# Altium schematic sheet Radio.SchDoc
size A
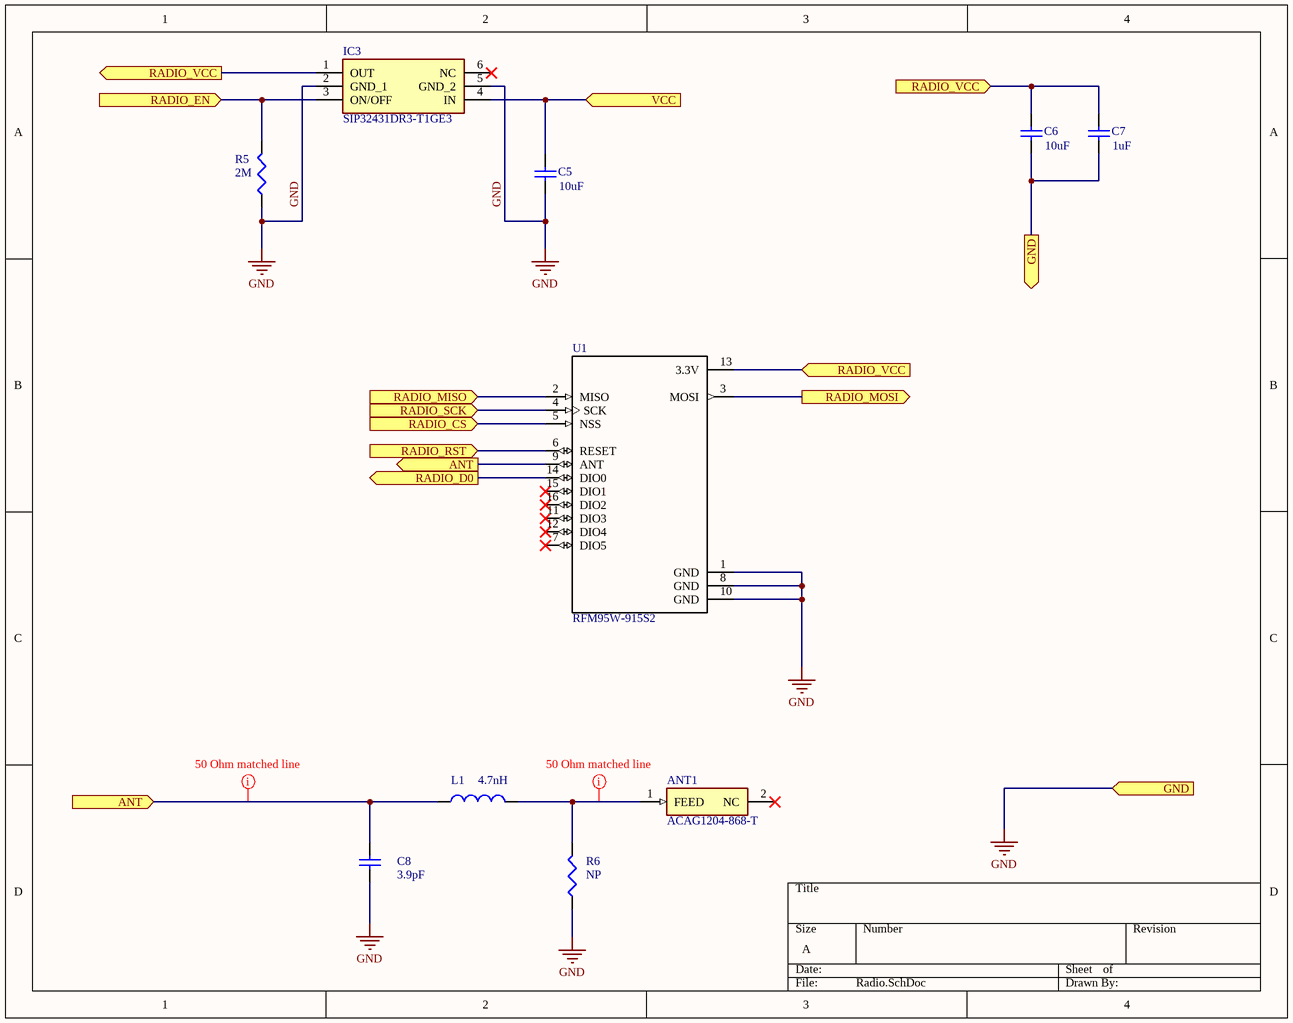
[diagram p0: Radio.SchDoc]

## Parts
ANT1  ACAG1204-868-T  [ANTC12040X170N]
C5  value 10uF  [1608[0603]]  (hidden comment: Cap)
C6  value 10uF  [1608[0603]]  (hidden comment: Cap)
C7  value 1uF  [1608[0603]]  (hidden comment: Cap)
C8  value 3.9pF  [1608[0603]]
IC3  SIP32431DR3-T1GE3  [SOT65P210X110-6N]
L1  value 4.7nH  [1608[0603]]
R5  value 2M  [J1-0603]  (hidden comment: Res3)
R6  value NP  [1608[0603]]
U1  RFM95W-915S2  [*XCVR_RFM69HW-868S2]

## Ports
ANT (in), ANT (out), GND (in), GND (out), RADIO_CS (in), RADIO_D0 (out), RADIO_EN (in), RADIO_MISO (in), RADIO_MOSI (out), RADIO_RST (in), RADIO_SCK (in), RADIO_VCC (in), RADIO_VCC (out), VCC (in)

## Nets
GND: C5.1 C6.1 C7.1 C8.1 IC3.2(GND_1) IC3.5(GND_2) R5.1 R6.1 U1.1(GND) U1.8(GND) U1.10(GND) ; port GND
ANT: C8.2 L1.1 U1.9(ANT) ; port ANT
RADIO_CS: U1.5(NSS) ; port RADIO_CS
RADIO_D0: U1.14(DIO0) ; port RADIO_D0
RADIO_EN: IC3.3(ON/OFF) R5.2 ; port RADIO_EN
RADIO_MISO: U1.2(MISO) ; port RADIO_MISO
RADIO_MOSI: U1.3(MOSI) ; port RADIO_MOSI
RADIO_RST: U1.6(RESET) ; port RADIO_RST
RADIO_SCK: U1.4(SCK) ; port RADIO_SCK
RADIO_VCC: C6.2 C7.2 IC3.1(OUT) U1.13(3.3V) ; port RADIO_VCC
VCC: C5.2 IC3.4(IN) ; port VCC
NetANT1_1: ANT1.1(FEED) L1.2 R6.2

Not connected (* = marked no-connect by the designer): ANT1 2(NC)*; IC3 6(NC)*; U1 7(DIO5)* 11(DIO3)* 12(DIO4)* 15(DIO1)* 16(DIO2)*

## Layout directives
rule Impedance Constraint [Min = 50.00    Max = 50.00    ]: ANT, NetANT1_1

## Library data of the parts
ANT1 = ACAG1204-868-T: Antenna; Manufacturer_Name: ABRACON; Datasheet Link: https://componentsearchengine.com/Datasheets/1/ACAG1204-868-T.pdf; Height: 1.7mm; Mouser Part Number: 815-G1204-868-T; Mouser Price/Stock: https://www.mouser.com/Search/Refine.aspx?Keyword=815-G1204-868-T; Manufacturer_Part_Number: ACAG1204-868-T
C5-C7 = Cap: CAP CER 6.3V X5R/X7R 0603; PackageReference: 0603; Publisher: Altium Limited; PackageDescription: Chip Capacitor, Body 1.6x0.8mm, IPC High Density
C8 = Cap: Capacitor; Published: 8-Jun-2000; LatestRevisionDate: 17-Jul-2002; LatestRevisionNote: Re-released for DXP Platform.; PackageReference: RAD-0.3; Publisher: Altium Limited; PackageDescription: Radial Cap, Thru-Hole; 2 Leads; 0.3 in Pin Spacing
IC3 = SIP32431DR3-T1GE3: 10 pA, Ultra Low Leakage and Quiescent Current, / Load Switch with Reverse Blocking; Manufacturer_Name: Vishay; Datasheet Link: https://componentsearchengine.com/Datasheets/1/SIP32431DR3-T1GE3.pdf; Height: 1.1mm; Mouser Part Number: 781-SIP32431DR3-GE3; Mouser Price/Stock: https://www.mouser.com/Search/Refine.aspx?Keyword=781-SIP32431DR3-GE3; Manufacturer_Part_Number: SIP32431DR3-T1GE3; ComponentLink1Description: Datasheet; ComponentLink1URL: https://www.vishay.com/docs/66597/sip32431.pdf; ComponentLink2Description: Package Specification; ComponentLink2URL: https://www.vishay.com/docs/71154/71154.pdf; ComponentLink3Description: Manufacturer URL; ComponentLink3URL: https://www.vishay.com
L1 = Inductor: Code_IEC: 1005; Published: 8-Jun-2000; LatestRevisionDate: 29-May-2009; LatestRevisionNote: IPC-7351 Footprint Added.; PackageReference: 0402-A; Publisher: Altium Limited; PackageDescription: Chip Inductor; Code_JEITA: 0402
R5 = Res3: RES 1/10W 1% 0603 SMD; PackageReference: 0603; Publisher: Altium Limited; PackageDescription: Chip Resistor, Body 1.6x0.8mm, IPC High Density
R6 = Res3: Resistor; Published: 8-Jun-2000; LatestRevisionDate: 29-May-2009; LatestRevisionNote: IPC-7351 Footprint Added.; PackageReference: J1-0603; Publisher: Altium Limited; PackageDescription: Chip Resistor
U1 = RFM95W-915S2: RFM95W LoRA Transceiver Module 915MHz; MF: RF Solutions; Availability: Unavailable; SnapEDA_Link: https://www.snapeda.com/parts/RFM95W-915S2/RF%20Solutions/view-part/?ref=snap; Price: None; Package: SMD-16 RF Solutions; MP: RFM95W-915S2; Value: *